# EAGLE design MIPI2HDMI (EAGLE 9.6.2)
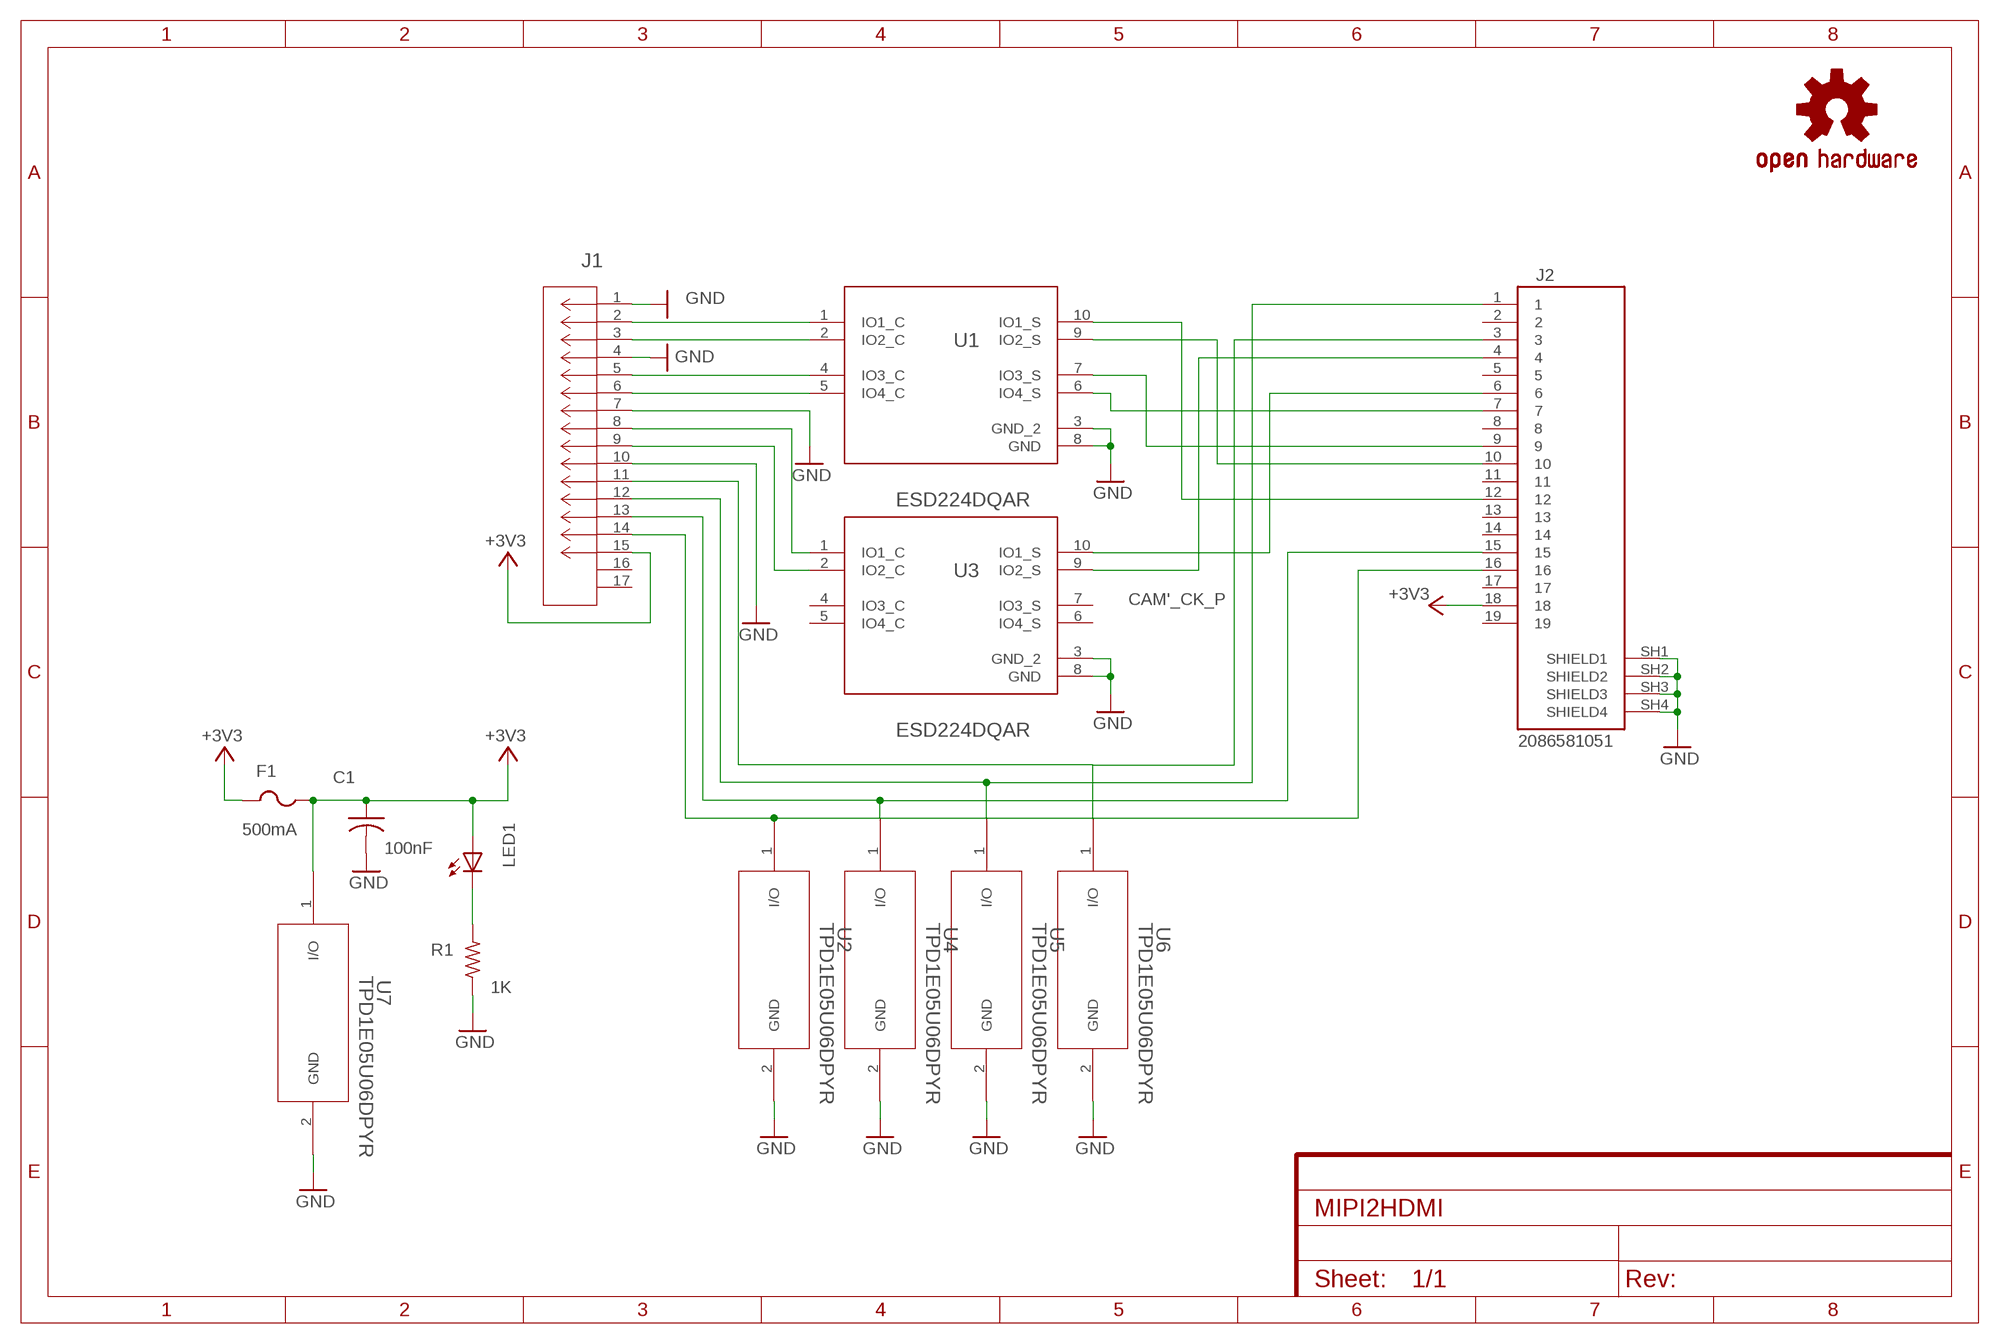
[diagram p0: schematic, sheet 1]

## Parts
C1  100nF  C-USC0603  [C0603]
F1  500mA  PTCFUSE-1206  [R1206]
J1  1-84952-5  [CONN15_1-84952-5_TEC]
J2  2086581051  [MOLEX_2086581051]
LED1  LEDCHIP-LED0603  [CHIP-LED0603]
LOGO1  OSHW-LOGOM  [OSHW-LOGO-M]
R1  1K  R-US_R0603  [R0603]
U1  ESD224DQAR  [DQA0010A]
U2  TPD1E05U06DPYR  [DPY2_TEX]
U3  ESD224DQAR  [DQA0010A]
U4  TPD1E05U06DPYR  [DPY2_TEX]
U5  TPD1E05U06DPYR  [DPY2_TEX]
U6  TPD1E05U06DPYR  [DPY2_TEX]
U7  TPD1E05U06DPYR  [DPY2_TEX]

## Nets
+3V3: C1.1 F1.1 F1.2 J1.15 J2.18 LED1.A U7.1(I/O)
CAM'_CK_N: J2.6 U3.10(IO1_S)
CAM'_CK_P: J2.4 U3.9(IO2_S)
CAM'_D0_N: J2.12 U1.10(IO1_S)
CAM'_D0_P: J2.10 U1.9(IO2_S)
CAM'_D1_N: J2.9 U1.7(IO3_S)
CAM'_D1_P: J2.7 U1.6(IO4_S)
CAM_CK_N: J1.8 U3.1(IO1_C)
CAM_CK_P: J1.9 U3.2(IO2_C)
CAM_D0_N: J1.2 U1.1(IO1_C)
CAM_D0_P: J1.3 U1.2(IO2_C)
CAM_D1_N: J1.5 U1.4(IO3_C)
CAM_D1_P: J1.6 U1.5(IO4_C)
CAM_MCLK: J1.12 J2.1 U5.1(I/O)
CAM_SCL: J1.13 J2.15 U4.1(I/O)
CAM_SDA: J1.14 J2.16 U2.1(I/O)
GND: C1.2 J1.1 J1.4 J1.7 J1.10 J2.SH1(SHIELD1) J2.SH2(SHIELD2) J2.SH3(SHIELD3) J2.SH4(SHIELD4) R1.1 U1.3(GND_2) U1.8(GND) U2.2(GND) U3.3(GND_2) U3.8(GND) U4.2(GND) U5.2(GND) U6.2(GND) U7.2(GND)
N$1: LED1.C R1.2
PWR_DN_LS: J1.11 J2.3 U6.1(I/O)
Unconnected: J1.16 J1.17 J2.2 J2.5 J2.8 J2.11 J2.13 J2.14 J2.17 J2.19 U3.4(IO3_C) U3.5(IO4_C) U3.6(IO4_S) U3.7(IO3_S)

## Library data of the parts
C1 = adafruit:C-US: CAPACITOR, American symbol
F1 = adafruit:PTCFUSE: PTC fuses, resettable thermistors
J1 = fpc15pin1mm:1-84952-5; COPYRIGHT: Copyright (C) 2024 Ultra Librarian. All rights reserved.; MANUFACTURER_PART_NUMBER: 1-84952-5; MFR_NAME: TE Connectivity; TYPE: Receptacle
J2 = 2086581051:2086581051; MANUFACTURER: Molex; MAXIMUM_PACKAGE_HEIGHT: 6.19mm; OPTION: MOLEX_CONFIG; PARTREV: A; STANDARD: Manufacturer Recommendations
LED1 = adafruit:LED: LED OSRAM: - CHIPLED LG R971, LG N971, LY N971, LG Q971, LY Q971, LO R971, LY R971 LH N974, LH R974 LS Q976, LO Q976, LY Q976 LO Q996 - Hyper CHIPLED LW Q18S LB Q993, LB Q99A, LB R99A - SideLED LS A670, LO A670, LY A670, LG A670, LP A670 LB A673, LV A673, LT A673, LW A673 LH A674 LY A675 LS A676, LA A676, LO A676, LY A676, LW A676 LS A679, LY A679, LG A679 - Hyper Micro SIDELED® LS Y876, LA Y876, LO Y876, LY Y876 LT Y87S - SmartLED LW L88C, LW L88S LB L89C, LB L89S, LG L890 LS L89K, LO L89K, LY L89K LS L896, LA L896, LO L896, LY L896 - TOPLED LS T670, LO T670, LY T670, LG T670, LP T670 LSG T670, LSP T670, LSY T670, LOP T670, LYG T670 LG T671, LOG T671, LSG T671 LB T673, LV T673, LT T673, LW T673 LH T674 LS T676, LA T676, LO T676, LY T676, LB T676, LH T676, LSB T676, LW T676 LB T67C, LV T67C, LT T67C, LS T67K, LO T67K, LY T67K, LW E67C LS E67B, LA E67B, LO E67B, LY E67B, LB E67C, LV E67C, LT E67C LW T67C LS T679, LY T679, LG T679 LS T770, LO T770, LY T770, LG T770, LP T770 LB T773, LV T773, LT T773, LW T773 LH T774 LS E675, LA E675, LY E675, LS T675 LS T776, LA T776, LO T776, LY T776, LB T776 LHGB T686 LT T68C, LB T68C - Hyper Mini TOPLED® LB M676 - Mini TOPLED Santana® LG M470 LS M47K, LO M47K, LY M47K Source: http://www.osram.convergy.de/
LOGO1 = SparkFun-Aesthetics:OSHW-LOGO: Open-Source Hardware (OSHW) Logo This logo indicates the piece of hardware it is found on incorporates a OSHW license and/or adheres to the definition of open source hardware found here: http://freedomdefined.org/OSHW
R1 = rcl:R-US_: RESISTOR, American symbol; SPICEPREFIX: R
U1 U3 = ESD224DQAR:ESD224DQAR; COPYRIGHT: Copyright (C) 2024 Ultra Librarian. All rights reserved.; MANUFACTURER_PART_NUMBER: ESD224DQAR; MFR_NAME: Texas Instruments; REFDES: RefDes; TYPE: TYPE
U2 U4-U7 = TPD1E05U06DPYR:TPD1E05U06DPYR; COPYRIGHT: Copyright (C) 2024 Ultra Librarian. All rights reserved.; MANUFACTURER_PART_NUMBER: TPD1E05U06DPYR; MFR_NAME: Texas Instruments

## Board
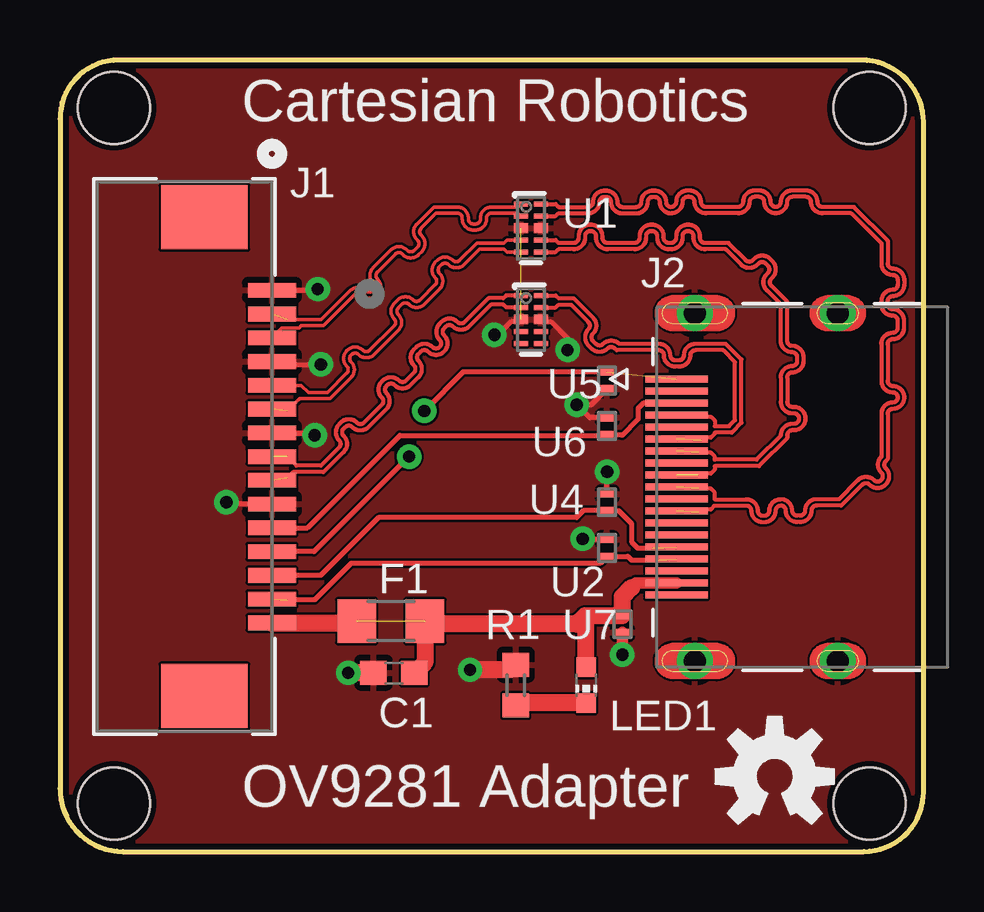
[diagram p1: board, top side]
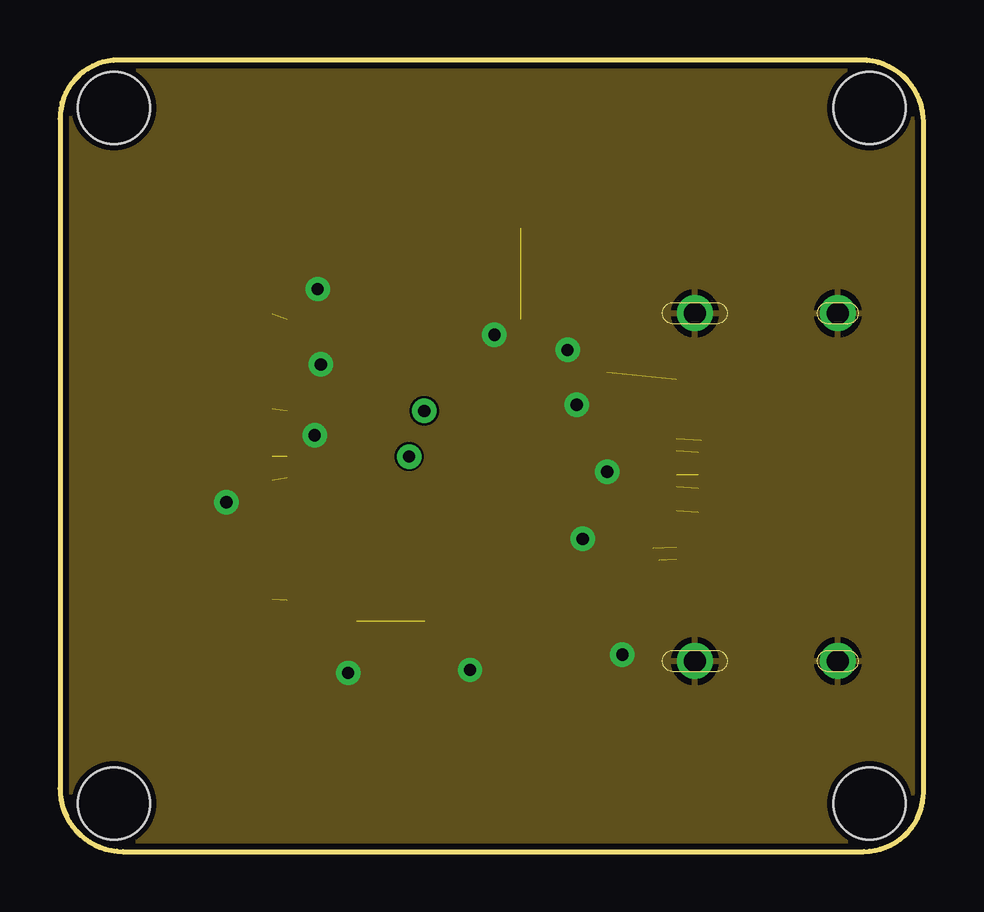
[diagram p2: board, inner layer Route2]
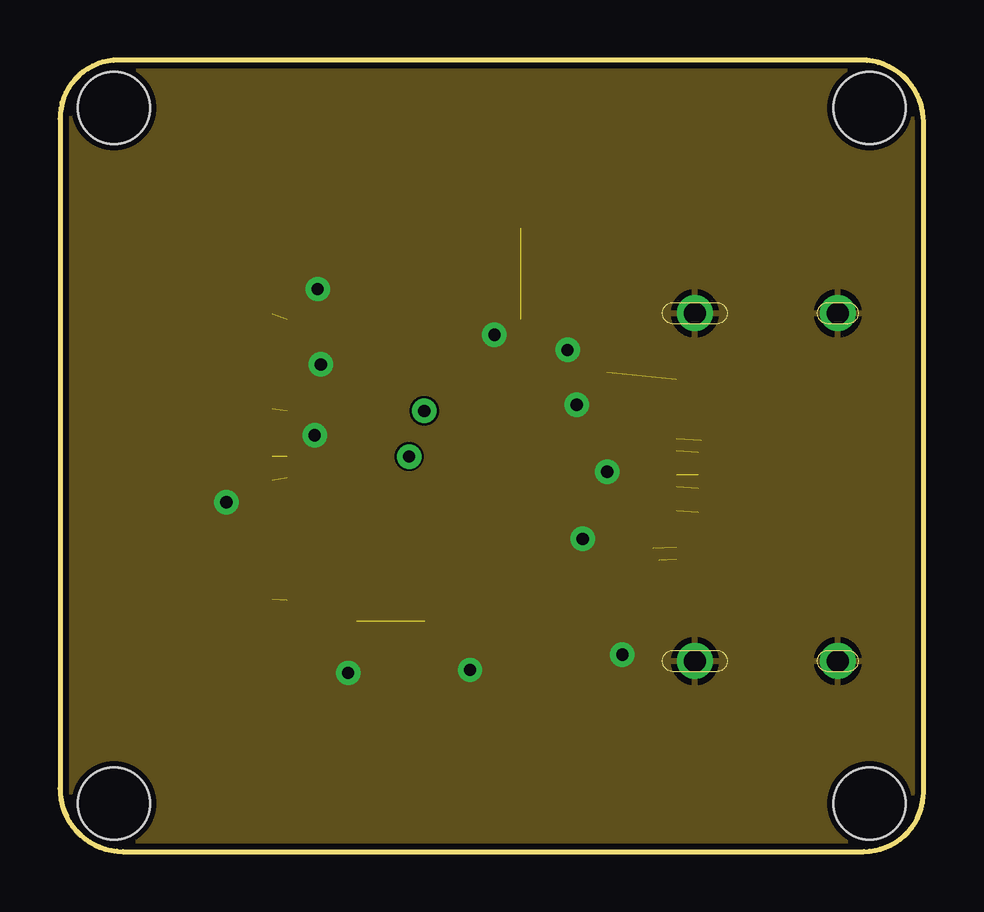
[diagram p3: board, inner layer Route15]
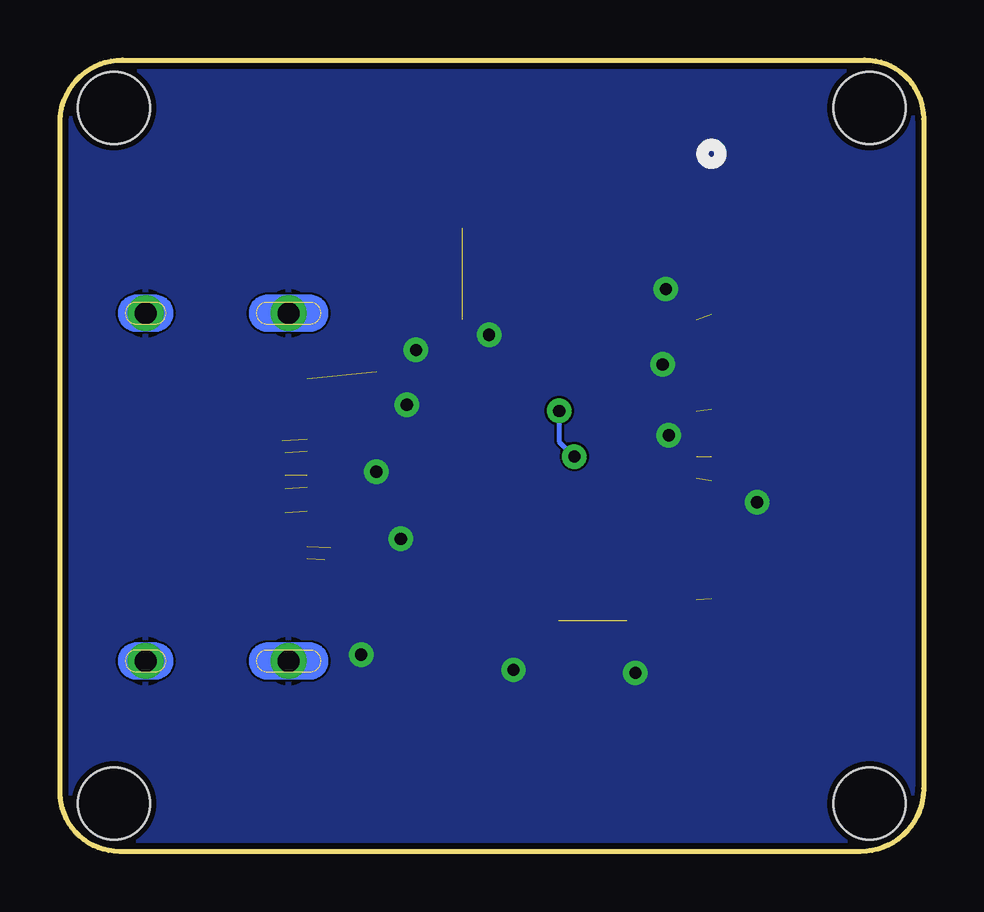
[diagram p4: board, bottom side, seen from below]

Size 36 x 33 mm. Coordinates in mm from the lower left corner, seen from the top.
Outline: 2.62,0 33.52,0 arc90 36,2.48 36,30.4 arc90 33.4,33 2.45,33 arc90 0,30.55 0,2.62 arc90 2.62,0
Copper layers (1+2*15+16): Top 0.035mm / dielectric 0.2104mm / Route2 0.0152mm / dielectric 1.065mm / Route15 0.0152mm / dielectric 0.2104mm / Bottom 0.035mm
Design rules "SparkFun *": minimum track width 5mil, minimum drill 20mil, track to track 4mil, track to pad 8mil, pad to pad 8mil, via to via 8mil, smd to smd 8mil, copper to edge 10mil, drill to drill 8mil, minimum pad ring 12mil, minimum via ring 10mil, stop-mask expansion 4mil, vias tented up to drill 25mil, thermal gap 10mil
Holes 3 mm at 2.25,31 2.25,2 33.75,31 33.75,2

### Footprints (pad centres in the part's own frame; a part is rotated, then mirrored left to right if it is on the bottom)
C0603 = smd 1.1 x 1: 1 -0.85,0; 2 0.85,0
R1206 = smd 1.6 x 1.803: 1 -1.422,0; 2 1.422,0
CONN15_1-84952-5_TEC = smd 0.61 x 2.007: 1 -6.934,0; 2 -5.944,0; 3 -4.953,0; 4 -3.962,0; 5 -2.972,0; 6 -1.981,0; 7 -0.991,0; 8 0,0; 9 0.991,0; 10 1.981,0; 11 2.972,0; 12 3.962,0; 13 4.953,0; 14 5.944,0; 15 6.934,0 | smd 2.667 x 3.607: 16 -9.982,-2.819; 17 9.982,-2.819
MOLEX_2086581051 = smd 0.298 x 2.6: 1 4.5,10.31; 2 4,10.31; 3 3.5,10.31; 4 3,10.31; 5 2.5,10.31; 6 2,10.31; 7 1.5,10.31; 8 1,10.31; 9 0.5,10.31; 10 0,10.31; 11 -0.5,10.31; 12 -1,10.31; 13 -1.5,10.31; 14 -2,10.31; 15 -2.5,10.31; 16 -3,10.31; 17 -3.5,10.31; 18 -4,10.31; 19 -4.5,10.31 | drill 0.9 pad 1.5: SH1 7.25,9.55; SH2 -7.25,9.55; SH3 7.25,3.59; SH4 -7.25,3.59
CHIP-LED0603 = smd 0.8 x 0.8: A 0,-0.75; C 0,0.75
R0603 = smd 1 x 1.1: 1 -0.85,0; 2 0.85,0
DQA0010A = smd 0.565 x 0.2: 1 -0.417,1; 2 -0.417,0.5; 4 -0.417,-0.5; 5 -0.417,-1; 6 0.417,-1; 7 0.417,-0.5; 9 0.417,0.5; 10 0.417,1 | smd 0.565 x 0.4: 3 -0.417,0; 8 0.417,0
DPY2_TEX = smd 0.3 x 0.55: 1 -0.35,0; 2 0.35,0

### Placement (x,y rotation side)
C1  13.92,7.45 180 top
F1  13.79,9.61 180 top
J1  8.84,16.47 270 top
J2  36.02,15.2 90 top
LED1  21.94,6.94 180 top
LOGO1  29.8,3.13 0 top
R1  19,6.94 270 top
U1  19.63,25.99 0 top
U2  22.81,12.66 90 top
U3  19.63,22.18 0 top
U4  22.81,14.56 90 top
U5  22.81,19.64 270 top
U6  22.81,17.73 90 top
U7  23.45,9.48 270 top

### Tracks (layer width: path | path; a pad name or v marks a point on that pad's centre or on a via)
+3V3  (1 unrouted)
  Top 0.483: J2.18 24.02,11.2 23.83,11
  Top 0.7: J1.15 12.3,9.53 F1.2 | C1.1 15.21,7.89 F1.1 15.34,9.48 21.54,9.48 21.89,9.83 | 21.89,9.83 U7.1 23.45,10.62 23.83,11 | LED1.A 21.94,9.78 21.89,9.83
CAM'_CK_N  (1 unrouted)
  Top 0.165: U3.10 20.66,23.18 20.78,23.06 21.41,23.06 22.22,22.26 arc-90 22.22,21.59 arc90 22.22,21.29 22.34,21.16 arc90 22.64,21.16 arc-90 23.31,21.16 24.97,21.16 arc-90 25.45,20.69 arc90 25.66,20.48 25.8,20.48 arc90 26.01,20.69 arc-90 26.49,21.16 27.76,21.16 28.41,20.51 28.41,17.88 28,17.47 27.29,17.47 27.29,17.43 27.13,17.26 26.91,17.26 26.78,17.13 26.75,17.13
CAM'_CK_P
  Top 0.165: U3.9 20.66,22.68 20.78,22.8 21.3,22.8 22.03,22.07 arc-90 22.03,21.78 arc90 22.03,21.1 22.16,20.98 arc90 22.83,20.98 arc-90 23.13,20.98 23.2,20.9 24.97,20.9 arc-90 25.18,20.69 arc90 25.66,20.21 25.8,20.21 arc90 26.28,20.69 arc-90 26.49,20.9 27.65,20.9 28.14,20.4 28.14,17.99 27.89,17.73 27.29,17.73 27.29,17.96 27.13,18.13 26.9,18.13 26.83,18.2 J2.4
CAM'_D0_N  (1 unrouted)
  Top 0.165: U1.10 20.66,26.99 20.78,26.87 22.02,26.87 arc90 22.23,27.08 arc-90 22.7,27.56 22.76,27.56 arc-90 23.24,27.08 arc90 23.45,26.87 24.03,26.87 arc90 24.24,27.08 arc-90 24.71,27.56 24.79,27.56 arc-90 25.27,27.08 arc90 25.48,26.87 arc90 25.69,27.08 arc-90 26.16,27.56 26.25,27.56 arc-90 26.72,27.08 arc90 26.93,26.87 28.27,26.87 arc90 28.48,27.08 arc-90 28.96,27.56 29.15,27.56 arc-90 29.63,27.08 arc90 29.84,26.87 arc90 30.05,27.08 arc-90 30.52,27.56 31.1,27.56 arc-90 31.58,27.08 arc90 31.78,26.87 33.1,26.87 34.51,25.47 34.51,24.52 arc90 34.72,24.31 arc-90 35.19,23.83 35.19,23.63 arc-90 34.72,23.15 arc90 34.51,22.94 34.51,22.81 arc90 34.72,22.61 arc-90 35.19,22.13 35.19,21.84 arc-90 34.72,21.37 arc90 34.51,21.16 34.51,19.62 arc90 34.72,19.41 arc-90 35.19,18.94 35.19,18.93 arc-90 34.72,18.45 arc90 34.51,18.24 34.51,16.35 34.43,16.28 arc90 34.43,15.98 arc-90 34.43,15.31 34.42,15.3 arc-90 33.75,15.3 arc90 33.45,15.3 32.57,14.42 31.54,14.42 arc90 31.33,14.21 arc-90 30.85,13.73 30.73,13.73 arc-90 30.26,14.21 arc90 30.05,14.42 arc90 29.84,14.21 arc-90 29.36,13.73 29.3,13.73 arc-90 28.82,14.21 arc90 28.61,14.42 27.29,14.42 27.13,14.26 26.83,14.26 26.7,14.13 26.62,14.13
CAM'_D0_P  (1 unrouted)
  Top 0.165: U1.9 20.66,26.49 20.78,26.61 22.02,26.61 arc90 22.49,27.08 arc-90 22.7,27.29 22.76,27.29 arc-90 22.97,27.08 arc90 23.45,26.61 24.03,26.61 arc90 24.5,27.08 arc-90 24.71,27.29 24.79,27.29 arc-90 25,27.08 arc90 25.48,26.61 arc90 25.95,27.08 arc-90 26.16,27.29 26.25,27.29 arc-90 26.45,27.08 arc90 26.93,26.61 28.27,26.61 arc90 28.75,27.08 arc-90 28.96,27.29 29.15,27.29 arc-90 29.36,27.08 arc90 29.84,26.61 arc90 30.31,27.08 arc-90 30.52,27.29 31.1,27.29 arc-90 31.31,27.08 arc90 31.78,26.61 32.99,26.61 34.24,25.35 34.24,24.52 arc90 34.72,24.04 arc-90 34.93,23.83 34.93,23.63 arc-90 34.72,23.42 arc90 34.24,22.94 34.24,22.81 arc90 34.72,22.34 arc-90 34.93,22.13 34.93,21.84 arc-90 34.72,21.63 arc90 34.24,21.16 34.24,19.62 arc90 34.72,19.15 arc-90 34.93,18.94 34.93,18.93 arc-90 34.72,18.72 arc90 34.24,18.24 34.24,16.47 arc90 34.24,15.79 arc-90 34.24,15.49 34.23,15.49 arc-90 33.94,15.49 arc90 33.26,15.49 32.46,14.69 31.54,14.69 arc90 31.06,14.21 arc-90 30.85,14 30.73,14 arc-90 30.52,14.21 arc90 30.05,14.69 arc90 29.57,14.21 arc-90 29.36,14 29.3,14 arc-90 29.09,14.21 arc90 28.61,14.69 27.29,14.69 27.29,14.96 27.13,15.13 26.62,15.13
CAM'_D1_N  (1 unrouted)
  Top 0.165: U1.7 20.66,25.49 20.78,25.37 21.41,25.37 arc90 21.62,25.58 21.62,25.66 arc-90 22.1,26.13 22.14,26.13 arc-90 22.62,25.66 22.62,25.58 arc90 22.82,25.37 23.95,25.37 arc90 24.16,25.58 24.16,25.66 arc-90 24.64,26.13 24.69,26.13 arc-90 25.17,25.66 25.17,25.58 arc90 25.38,25.37 25.48,25.37 arc90 25.69,25.58 25.69,25.66 arc-90 26.16,26.13 26.2,26.13 arc-90 26.68,25.66 26.68,25.58 arc90 26.89,25.37 27.87,25.37 28.59,24.65 arc90 28.88,24.65 28.93,24.7 arc-90 29.61,24.7 29.7,24.61 arc-90 29.7,23.94 29.65,23.88 arc90 29.65,23.59 30.32,22.92 30.32,21.29 arc90 30.52,21.08 arc-90 31,20.6 31,20.45 arc-90 30.52,19.98 arc90 30.32,19.77 30.32,18.75 arc90 30.52,18.54 30.6,18.54 arc-90 31.07,18.06 31.07,18.04 arc-90 30.6,17.56 30.52,17.56 arc90 30.32,17.35 30.32,17.24 29.14,16.07 27.29,16.07 27.29,15.93 27.13,15.76 26.68,15.76 26.62,15.7
CAM'_D1_P  (1 unrouted)
  Top 0.165: U1.6 20.66,24.99 20.78,25.11 21.41,25.11 arc90 21.89,25.58 21.89,25.66 arc-90 22.1,25.86 22.14,25.86 arc-90 22.35,25.66 22.35,25.58 arc90 22.82,25.11 23.95,25.11 arc90 24.43,25.58 24.43,25.66 arc-90 24.64,25.86 24.69,25.86 arc-90 24.9,25.66 24.9,25.58 arc90 25.38,25.11 25.48,25.11 arc90 25.95,25.58 25.95,25.66 arc-90 26.16,25.86 26.2,25.86 arc-90 26.41,25.66 26.41,25.58 arc90 26.89,25.11 27.76,25.11 28.4,24.47 arc90 29.07,24.47 29.12,24.52 arc-90 29.42,24.52 29.52,24.42 arc-90 29.52,24.12 29.47,24.07 arc90 29.47,23.4 30.05,22.81 30.05,21.29 arc90 30.52,20.81 arc-90 30.73,20.6 30.73,20.45 arc-90 30.52,20.24 arc90 30.05,19.77 30.05,18.75 arc90 30.52,18.27 30.6,18.27 arc-90 30.81,18.06 30.81,18.04 arc-90 30.6,17.83 30.52,17.83 arc90 30.05,17.35 29.03,16.34 27.29,16.34 27.29,16.46 27.13,16.63 26.62,16.63
CAM_CK_N  (1 unrouted)
  Top 0.165: U3.1 18.61,23.18 18.49,23.06 17.86,23.06 16.87,22.08 arc-90 16.57,22.08 arc90 15.9,22.08 15.83,22.01 arc90 15.83,21.33 arc-90 15.83,21.03 | 15.83,21.03 arc-90 15.53,21.03 arc90 14.86,21.03 14.76,20.94 arc90 14.76,20.27 arc-90 14.76,19.97 14.43,19.64 arc-90 14.13,19.64 arc90 13.46,19.64 13.42,19.6 arc90 13.42,18.92 arc-90 13.42,18.63 12.67,17.88 arc-90 12.38,17.88 arc90 11.7,17.88 11.64,17.81 arc90 11.64,17.14 arc-90 11.64,16.84 10.88,16.08 9.86,16.08 9.48,16.47 | 15.83,21.03
CAM_CK_P  (1 unrouted)
  Top 0.165: U3.2 18.61,22.68 18.49,22.8 17.97,22.8 17.06,21.89 arc-90 16.38,21.89 arc90 16.09,21.89 16.02,21.82 arc90 16.02,21.52 arc-90 16.02,20.85 16.02,20.85 arc-90 15.34,20.85 arc90 15.05,20.85 14.95,20.75 arc90 14.95,20.45 arc-90 14.95,19.78 14.62,19.45 arc-90 13.95,19.45 arc90 13.65,19.45 13.61,19.41 arc90 13.61,19.11 arc-90 13.61,18.44 12.86,17.69 arc-90 12.19,17.69 arc90 11.89,17.69 11.82,17.62 arc90 11.82,17.33 arc-90 11.82,16.66 10.99,15.82 9.72,15.82 9.48,15.58
CAM_D0_N  (1 unrouted)
  Top 0.152: 9.48,22.18 10.89,22.18 12.09,23.38 arc-90 12.74,23.38 arc90 13.02,23.38 13.05,23.41 arc90 13.05,23.7 arc-90 13.05,24.34 13.8,25.09 arc-90 14.45,25.09 14.48,25.06 arc90 14.77,25.06 14.91,25.2 arc90 14.91,25.48 14.88,25.52 arc-90 14.88,26.16 15.59,26.87 16.57,26.87 arc-90 17.02,26.41 17.02,26.37 arc90 17.23,26.16 17.32,26.16 arc90 17.53,26.37 17.53,26.41 arc-90 17.98,26.87 18.82,26.87 19.1,26.87 U1.1
CAM_D0_P
  Top 0.152: J1.3 9.25,21.82 9.96,21.82 10.06,21.93 11,21.93 12.27,23.2 arc-90 12.56,23.2 arc90 13.2,23.2 13.23,23.23 arc90 13.23,23.87 arc-90 13.23,24.16 13.98,24.91 arc-90 14.27,24.91 14.3,24.88 arc90 14.95,24.88 15.09,25.02 arc90 15.09,25.66 15.05,25.7 arc-90 15.05,25.98 15.69,26.61 16.57,26.61 arc-90 16.77,26.41 16.77,26.37 arc90 17.23,25.91 17.32,25.91 arc90 17.78,26.37 17.78,26.41 arc-90 17.98,26.61 18.82,26.61 19.1,26.61 U1.2
CAM_D1_N
  Top 0.152: U1.4 18.63,25.49 18.51,25.37 17.38,25.37 16.66,24.65 arc-90 16.38,24.65 arc90 15.73,24.65 15.64,24.56 arc90 15.64,23.92 arc-90 15.64,23.63 15.01,22.99 arc-90 14.72,22.99 arc90 14.08,22.99 13.93,22.85 arc90 13.93,22.2 arc-90 13.93,21.91 12.91,20.9 arc-90 12.63,20.9 arc90 11.98,20.9 11.96,20.88 arc90 11.96,20.23 arc-90 11.96,19.94 11.15,19.13 10.36,19.13 10.06,19.44 J1.5
CAM_D1_P  (1 unrouted)
  Top 0.152: U1.5 18.63,24.99 18.51,25.11 17.49,25.11 16.84,24.47 arc-90 16.2,24.47 arc90 15.91,24.47 15.82,24.38 arc90 15.82,24.1 arc-90 15.82,23.45 15.19,22.81 arc-90 14.54,22.81 arc90 14.26,22.81 14.11,22.67 arc90 14.11,22.38 arc-90 14.11,21.73 13.09,20.72 arc-90 12.45,20.72 arc90 12.16,20.72 12.14,20.7 arc90 12.14,20.41 arc-90 12.14,19.76 11.25,18.88 9.98,18.88 9.96,18.85 9.48,18.37
CAM_MCLK  (via drill 0.51)  (1 unrouted)
  Top 0.203: U5.1 16.81,19.99 v15.19,18.37 | v14.55,16.47 10.59,12.5 J1.12
  Bottom 0.203: v15.19,18.37 15.19,17.1 v14.55,16.47
CAM_SCL  (1 unrouted)
  Top 0.203: 24.72,12.66 24.08,12.66 23.83,12.91 23.83,13.67 23.29,14.21 U4.1 21.83,14.21 21.54,13.92 13.29,13.92 10.87,11.51 9.35,11.51 | 9.35,11.51 9.35,11.64 | J1.13 9.35,11.51
CAM_SDA  (2 unrouted)
  Top 0.203: 24.97,12.15 23.82,12.15 23.67,12.3 U2.1 22.52,12.02 12.14,12.02 10.62,10.5 9.48,10.5
GND  (via drill 0.51)  (1 unrouted)
  Top 0.203: J1.7 10.52,17.46 v10.62,17.35 | J1.4 8.96,20.31 v10.87,20.31 | U3.8 20.15,22.09 20.46,22.09 21.16,21.39 v21.16,20.91 | U3.3 19.12,22.09 18.81,22.09 18.27,21.55 v18.11,21.55 | U6.2 22.08,18.09 v21.54,18.62 22.14,18.62 U5.2 | U4.2 v22.81,15.83 | U2.2 21.83,13.01 v21.79,13.04 | J1.1 10.69,23.4 v10.75,23.45 | J1.10 7.01,14.48 v6.93,14.56
  Top 0.483: U7.2 v23.45,8.21
  Top 0.7: C1.2 v12.02,7.45 | R1.1 18.79,7.57 v17.09,7.57
  pour Top: -1.96,31.07 -1.96,-1.95 37.41,-1.95 38.05,-1.95 38.05,34.88 -1.96,34.88
  pour Route2: -3.22,35.52 -3.22,-3.86 39.32,-3.86 39.32,36.15 -3.22,36.15
  pour Route15: -4.49,37.42 -4.49,-6.39 41.23,-6.39 41.23,37.42
  pour Bottom: -5.76,38.69 -5.76,-8.3 42.49,-8.3 42.49,39.33 -5.76,39.33
N$1
  Top 0.7: LED1.C 19.1,6.19 R1.2
PWR_DN_LS
  Top 0.203: J1.11 10.31,13.49 14.17,17.35 22.78,17.35 U6.1 23.41,17.38 23.45,17.35 24.1,18.01 24.1,18.47 24.33,18.7 J2.3

### Text on the board
tPlace: Cartesian Robotics | OV9281 Adapter